# Altium schematic sheet Logic_controller.SchDoc
size A2; SheetNumber: 4; SheetTotal: 6
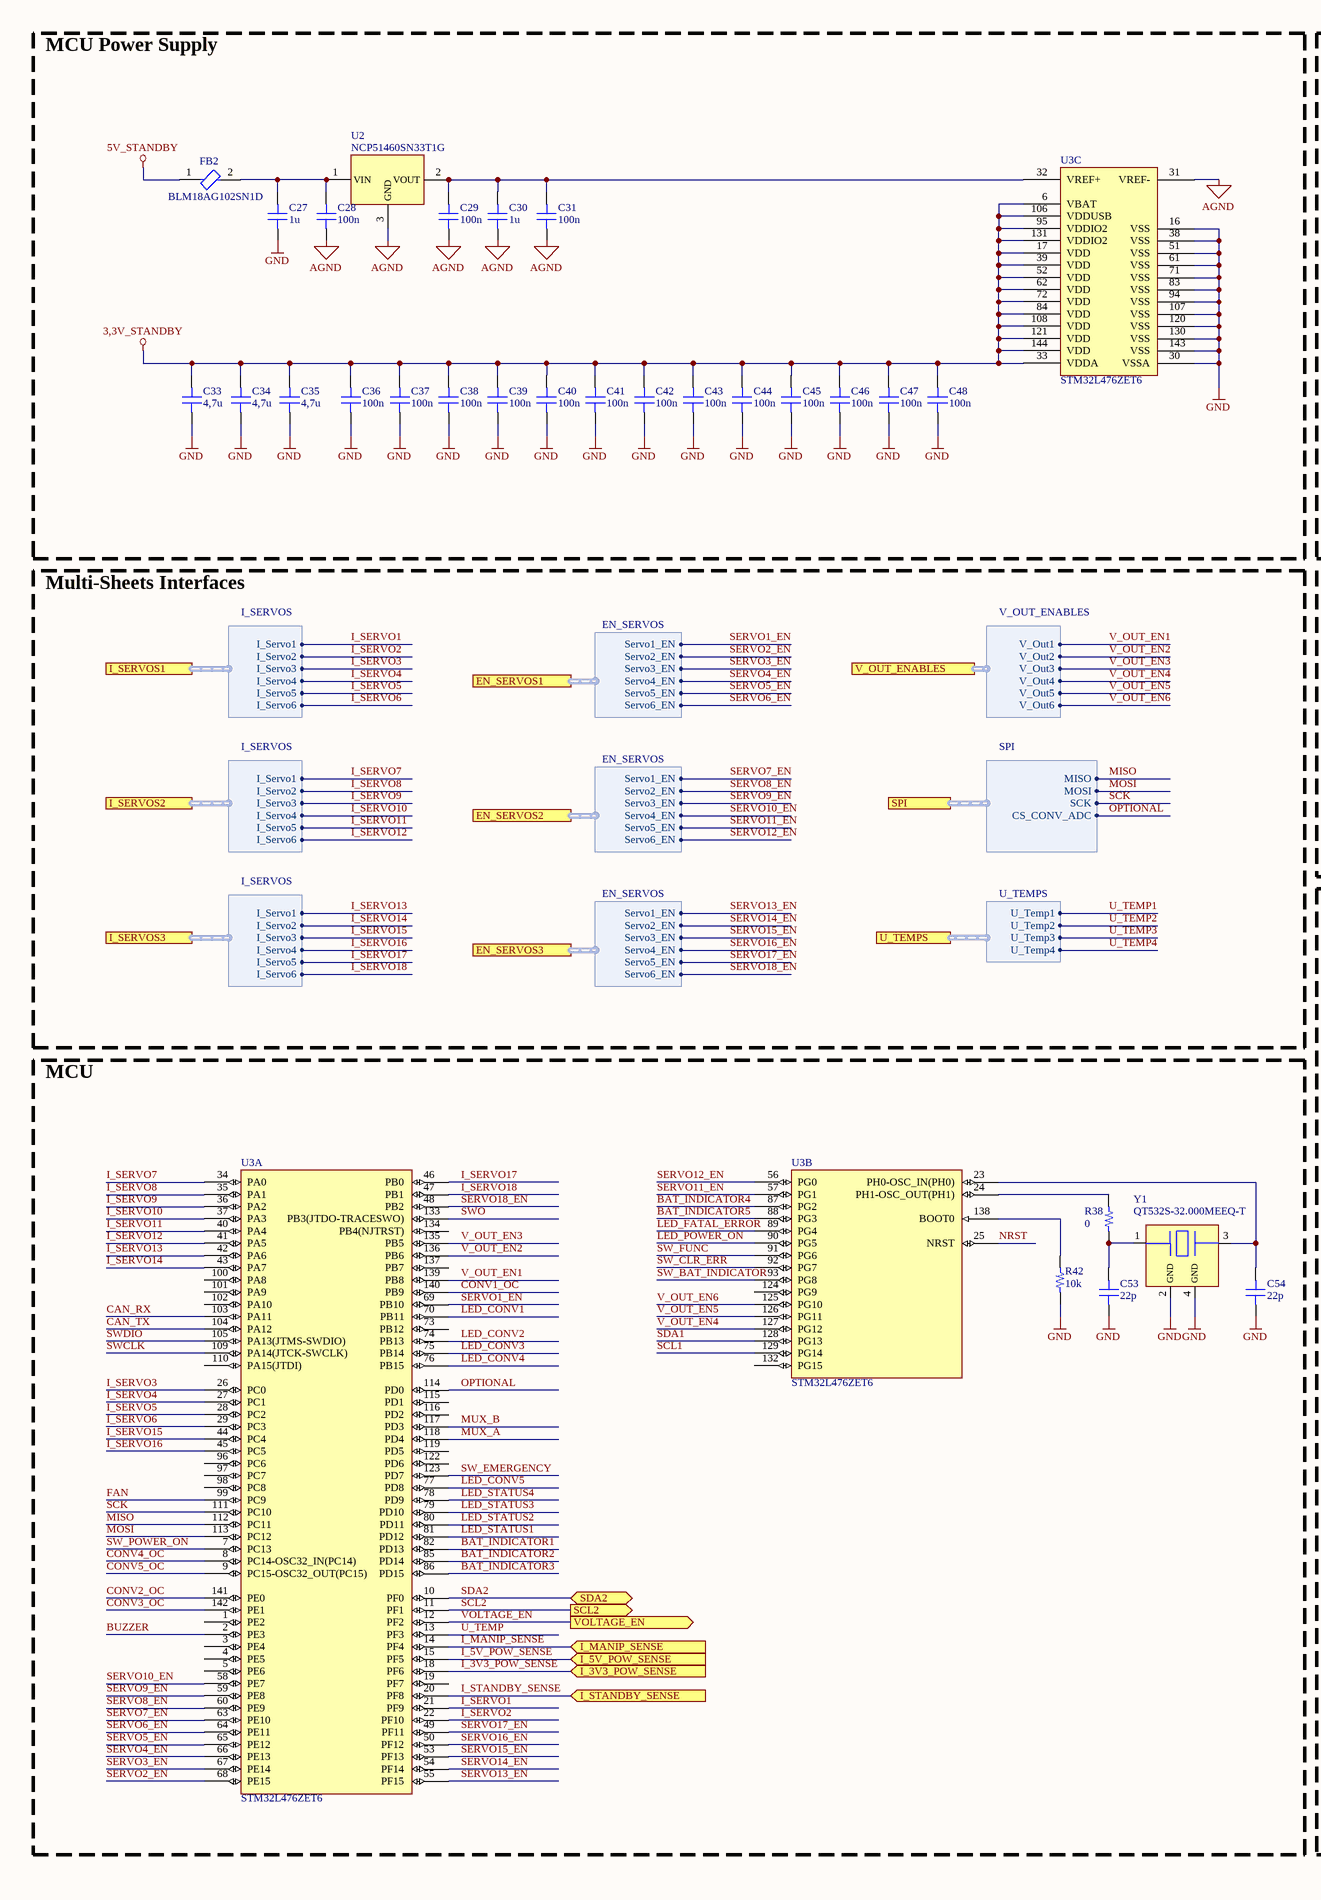
[diagram p0: Logic_controller.SchDoc, left]
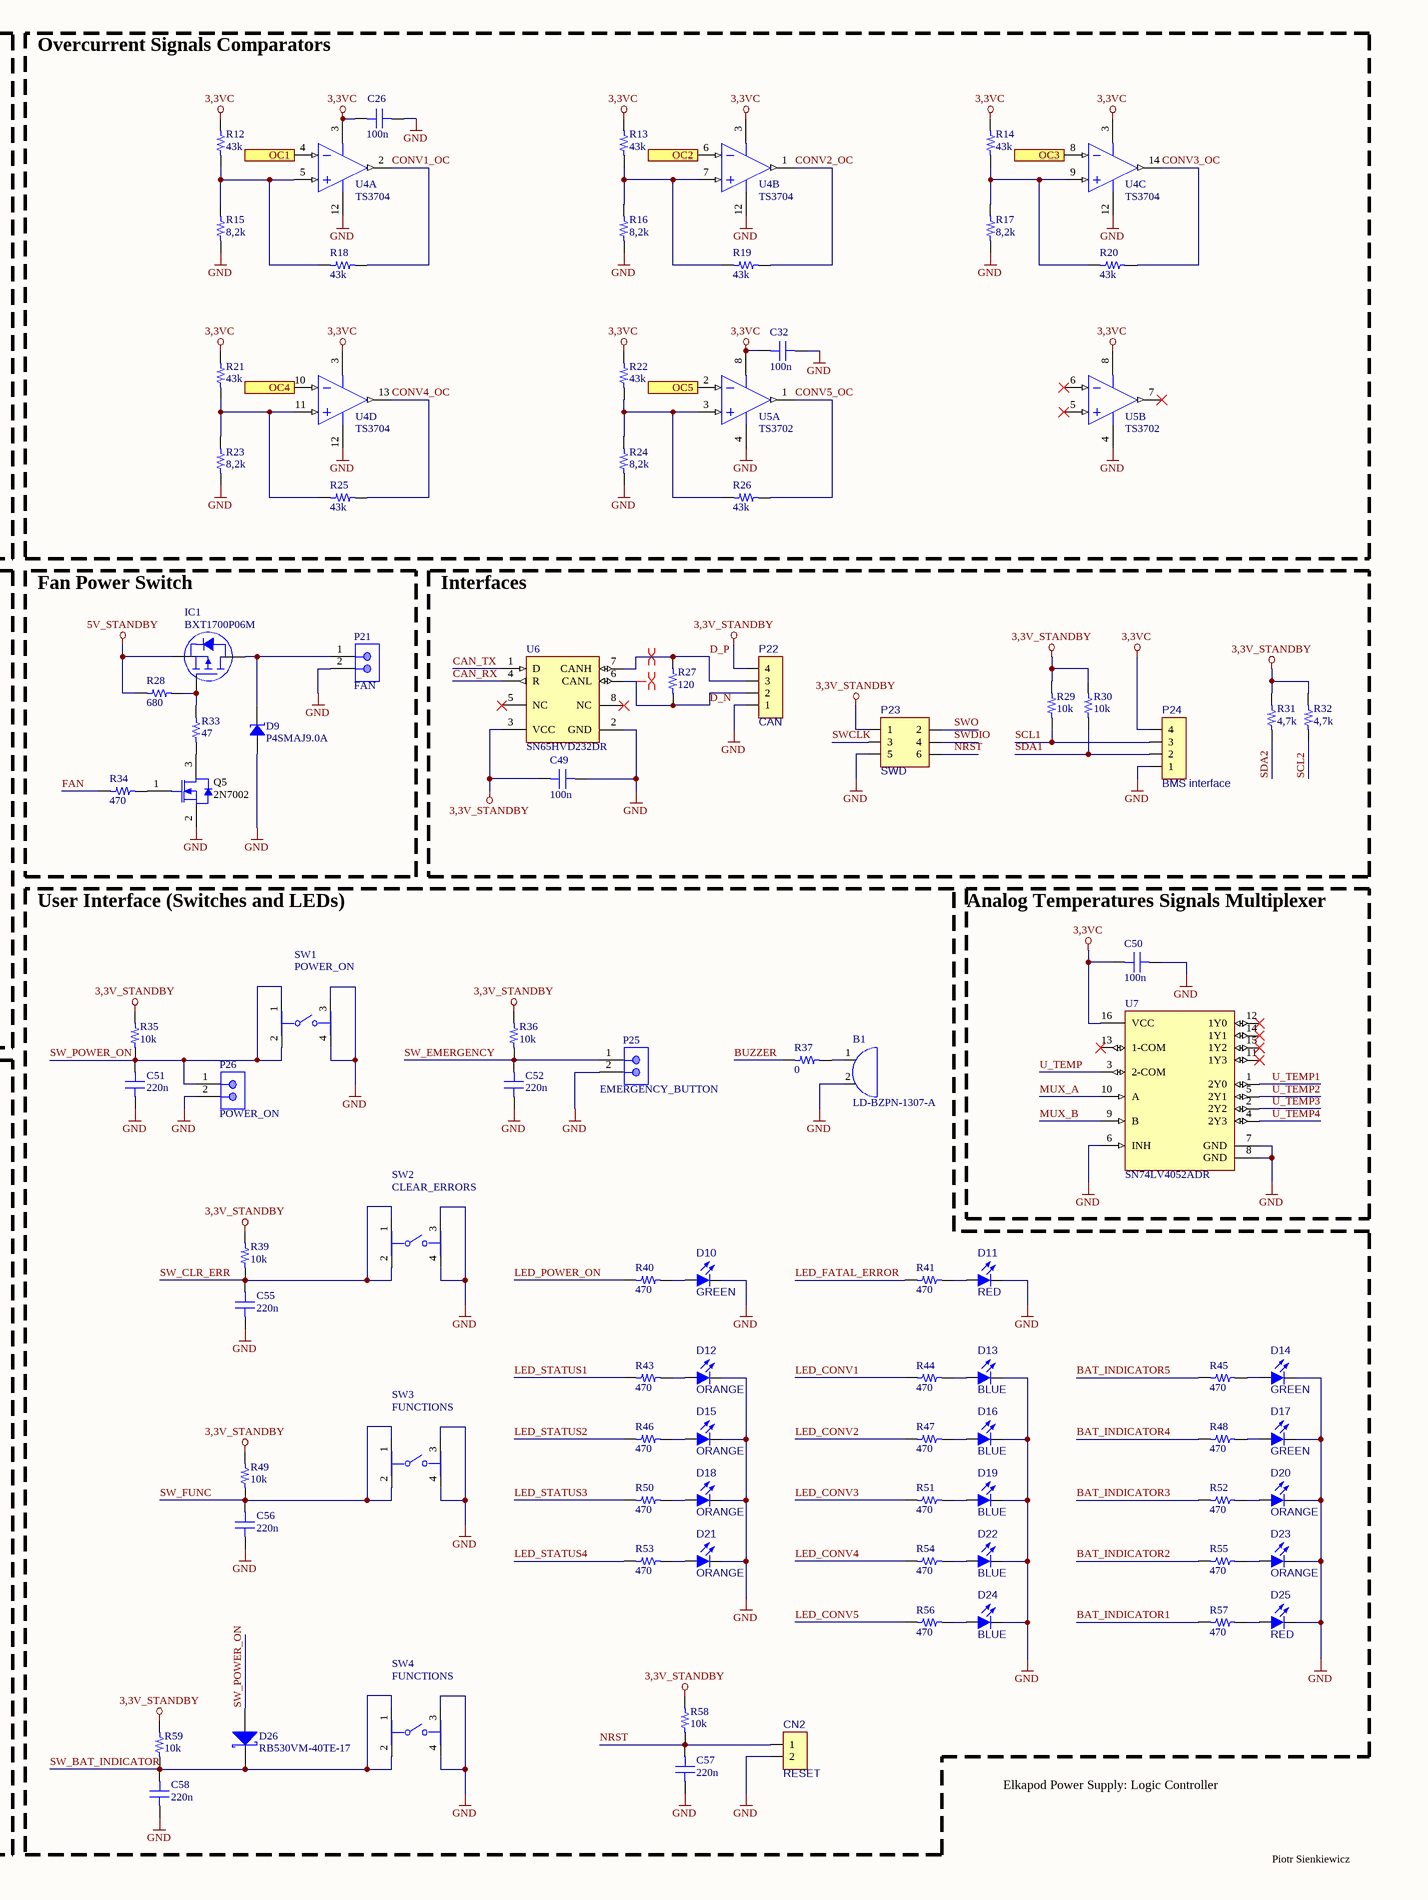
[diagram p1: Logic_controller.SchDoc, right]

## Parts
B1  LD-BZPN-1307-A  [LD-BZPN-1307-A]
C26  100n  [CAP 0603_1608]
C27  1u  [CAP 0603_1608]
C28  100n  [CAP 0603_1608]
C29  100n  [CAP 0603_1608]
C30  1u  [CAP 0603_1608]
C31  100n  [CAP 0603_1608]
C32  100n  [CAP 0603_1608]
C33  4,7u  [CAP 0603_1608]
C34  4,7u  [CAP 0603_1608]
C35  4,7u  [CAP 0603_1608]
C36  100n  [CAP 0603_1608]
C37  100n  [CAP 0603_1608]
C38  100n  [CAP 0603_1608]
C39  100n  [CAP 0603_1608]
C40  100n  [CAP 0603_1608]
C41  100n  [CAP 0603_1608]
C42  100n  [CAP 0603_1608]
C43  100n  [CAP 0603_1608]
C44  100n  [CAP 0603_1608]
C45  100n  [CAP 0603_1608]
C46  100n  [CAP 0603_1608]
C47  100n  [CAP 0603_1608]
C48  100n  [CAP 0603_1608]
C49  100n  [CAP 0603_1608]
C50  100n  [CAP 0603_1608]
C51  220n  [CAP 0603_1608]
C52  220n  [CAP 0603_1608]
C53  22p  [CAP 0603_1608]
C54  22p  [CAP 0603_1608]
C55  220n  [CAP 0603_1608]
C56  220n  [CAP 0603_1608]
C57  220n  [CAP 0603_1608]
C58  220n  [CAP 0603_1608]
CN2  RESET  [GP_2x1]
D9  P4SMAJ9.0A  [DO214AC SMA]
D10  GREEN  [LED0805B]
D11  RED  [LED0805B]
D12  ORANGE  [LED0805B]
D13  BLUE  [LED0805B]
D14  GREEN  [LED0805B]
D15  ORANGE  [LED0805B]
D16  BLUE  [LED0805B]
D17  GREEN  [LED0805B]
D18  ORANGE  [LED0805B]
D19  BLUE  [LED0805B]
D20  ORANGE  [LED0805B]
D21  ORANGE  [LED0805B]
D22  BLUE  [LED0805B]
D23  ORANGE  [LED0805B]
D24  BLUE  [LED0805B]
D25  RED  [LED0805B]
D26  RB530VM-40TE-17  [SOD-323]
FB2  BLM18AG102SN1D  [FP-BLM18-0_15-t0_8-MFG]
IC1  BXT1700P06M  [ON SEMI SOT-23-3]
P21  FAN  [MOLX-22-23-2021_V]
P22  CAN  [KK/2.54/4]
P23  SWD  [GP_3x2]
P24  BMS interface  [KK/2.54/4]
P25  EMERGENCY_BUTTON  [MOLX-22-23-2021_V]
P26  POWER_ON  [MOLX-22-23-2021_V]
Q5  2N7002  [INF-PG-SOT23_M]
R12  43k  [RES 0603_1608]
R13  43k  [RES 0603_1608]
R14  43k  [RES 0603_1608]
R15  8,2k  [RES 0603_1608]
R16  8,2k  [RES 0603_1608]
R17  8,2k  [RES 0603_1608]
R18  43k  [RES 0603_1608]
R19  43k  [RES 0603_1608]
R20  43k  [RES 0603_1608]
R21  43k  [RES 0603_1608]
R22  43k  [RES 0603_1608]
R23  8,2k  [RES 0603_1608]
R24  8,2k  [RES 0603_1608]
R25  43k  [RES 0603_1608]
R26  43k  [RES 0603_1608]
R27  120  [RES 0603_1608]
R28  680  [RES 0603_1608]
R29  10k  [RES 0603_1608]
R30  10k  [RES 0603_1608]
R31  4,7k  [RES 0603_1608]
R32  4,7k  [RES 0603_1608]
R33  47  [RES 0603_1608]
R34  470  [RES 0603_1608]
R35  10k  [RES 0603_1608]
R36  10k  [RES 0603_1608]
R37  0  [RES 0603_1608]
R38  0  [RES 0603_1608]
R39  10k  [RES 0603_1608]
R40  470  [RES 0603_1608]
R41  470  [RES 0603_1608]
R42  10k  [RES 0603_1608]
R43  470  [RES 0603_1608]
R44  470  [RES 0603_1608]
R45  470  [RES 0603_1608]
R46  470  [RES 0603_1608]
R47  470  [RES 0603_1608]
R48  470  [RES 0603_1608]
R49  10k  [RES 0603_1608]
R50  470  [RES 0603_1608]
R51  470  [RES 0603_1608]
R52  470  [RES 0603_1608]
R53  470  [RES 0603_1608]
R54  470  [RES 0603_1608]
R55  470  [RES 0603_1608]
R56  470  [RES 0603_1608]
R57  470  [RES 0603_1608]
R58  10k  [RES 0603_1608]
R59  10k  [RES 0603_1608]
SW1  POWER_ON  [FP-B3FS-1000-MFG]
SW2  CLEAR_ERRORS  [FP-B3FS-1000-MFG]
SW3  FUNCTIONS  [FP-B3FS-1000-MFG]
SW4  FUNCTIONS  [FP-B3FS-1000-MFG]
U2  NCP51460SN33T1G  [SOT23-3]
U3  STM32L476ZET6  [STM-LQFP144_M]  (parts A,B,C of 3)
U4  TS3704  [SOIC14]  (parts A,B,C,D of 4)
U5  TS3702  [SOIC8]  (parts A,B of 2)
U6  SN65HVD232DR  [D0008A_M]
U7  SN74LV4052ADR  [FP-D0016A-IPC_B]
Y1  QT532S-32.000MEEQ-T  [QT532S_5,0x3,2_crystal]

## Blocks framed on the sheet
MCU Power Supply: C27-C31 C33-C48 FB2 U2 U3
Overcurrent Signals Comparators: C26 C32 R12-R26 U4 U5
Fan Power Switch: D9 IC1 P21 Q5 R28 R33 R34
Interfaces: C49 P22-P24 R27 R29-R32 U6
User Interface (Switches and LEDs): B1 C51 C52 C55-C58 CN2 D10-D26 P25 P26 R35-R37 R39-R41 R43-R59 SW1-SW4
Analog Temperatures Signals Multiplexer: C50 U7
MCU: C53 C54 R38 R42 U3 Y1

## Ports
EN_SERVOS1 (harness EN_SERVOS, see Elkapod_power_supply_controller_module[3C]), EN_SERVOS2 (harness EN_SERVOS, see Elkapod_power_supply_controller_module[3D]), EN_SERVOS3 (harness EN_SERVOS, see Elkapod_power_supply_controller_module[3D]), I_3V3_POW_SENSE (in, see Elkapod_power_supply_controller_module[3C]), I_5V_POW_SENSE (in, see Elkapod_power_supply_controller_module[3C]), I_MANIP_SENSE (in, see Elkapod_power_supply_controller_module[3C]), I_SERVOS1 (harness I_SERVOS, see Elkapod_power_supply_controller_module[3C]), I_SERVOS2 (harness I_SERVOS, see Elkapod_power_supply_controller_module[3D]), I_SERVOS3 (harness I_SERVOS, see Elkapod_power_supply_controller_module[3D]), I_STANDBY_SENSE (in, see Elkapod_power_supply_controller_module[3C]), OC1 (in, see Elkapod_power_supply_controller_module[3C]), OC2 (in, see Elkapod_power_supply_controller_module[3C]), OC3 (in, see Elkapod_power_supply_controller_module[3C]), OC4 (in, see Elkapod_power_supply_controller_module[3C]), OC5 (in, see Elkapod_power_supply_controller_module[3C]), SCL2 (out, see Elkapod_power_supply_controller_module[3C]), SDA2 (bidir, see Elkapod_power_supply_controller_module[3C]), SPI (harness SPI, see Elkapod_power_supply_controller_module[5C]), U_TEMPS (harness U_TEMPS, see Elkapod_power_supply_controller_module[5C]), V_OUT_ENABLES (harness V_OUT_ENABLES, see Elkapod_power_supply_controller_module[5D], Controllable_voltage_outputs[2A]), VOLTAGE_EN (out, see Elkapod_power_supply_controller_module[5C])

## Harnesses
I_SERVOS: I_Servo1, I_Servo2, I_Servo3, I_Servo4, I_Servo5, I_Servo6
V_OUT_ENABLES: V_Out1, V_Out2, V_Out3, V_Out4, V_Out5, V_Out6
SPI: MISO, MOSI, SCK, CS_CONV_ADC
EN_SERVOS: Servo1_EN, Servo2_EN, Servo3_EN, Servo4_EN, Servo5_EN, Servo6_EN
U_TEMPS: U_Temp1, U_Temp2, U_Temp3, U_Temp4

## Nets
3,3V_STANDBY: C33.2 C34.2 C35.2 C36.2 C37.2 C38.2 C39.2 C40.2 C41.2 C42.2 C43.2 C44.2 C45.2 C46.2 C47.2 C48.2 C49.2 P22.4 P23.1 R29.1 R30.1 R31.1 R32.1 R35.1 R36.1 R39.1 R49.1 R58.1 R59.1 U3.6(VBAT) U3.17(VDD) U3.33(VDDA) U3.39(VDD) U3.52(VDD) U3.62(VDD) U3.72(VDD) U3.84(VDD) U3.95(VDDIO2) U3.106(VDDUSB) U3.108(VDD) U3.121(VDD) U3.131(VDDIO2) U3.144(VDD) U6.3(VCC)
3,3VC: C26.2 C32.2 C50.2 P24.4 R12.2 R13.2 R14.2 R21.2 R22.2 U4.3(V+) U5.8(V+) U7.16(VCC)
5V_STANDBY: FB2.1 IC1.2(S) R28.1
AGND: C28.1 C29.1 C30.1 C31.1 U2.3(GND) U3.31(VREF-)
GND: B1.2 C26.1 C27.1 C32.1 C33.1 C34.1 C35.1 C36.1 C37.1 C38.1 C39.1 C40.1 C41.1 C42.1 C43.1 C44.1 C45.1 C46.1 C47.1 C48.1 C49.1 C50.1 C51.1 C52.1 C53.1 C54.1 C55.1 C56.1 C57.1 C58.1 CN2.2 D9.1 D10.2(K) D11.2(K) D12.2(K) D13.2(K) D14.2(K) D15.2(K) D16.2(K) D17.2(K) D18.2(K) D19.2(K) D20.2(K) D21.2(K) D22.2(K) D23.2(K) D24.2(K) D25.2(K) P21.2 P22.1 P23.5 P24.1 P25.2 P26.2 Q5.2(SOURCE) R15.2 R16.2 R17.2 R23.2 R24.2 R42.2 SW1.3 SW1.4 SW2.3 SW2.4 SW3.3 SW3.4 SW4.3 SW4.4 U3.16(VSS) U3.30(VSSA) U3.38(VSS) U3.51(VSS) U3.61(VSS) U3.71(VSS) U3.83(VSS) U3.94(VSS) U3.107(VSS) U3.120(VSS) U3.130(VSS) U3.143(VSS) U4.12(GND) U5.4(GND) U6.2(GND) U7.6(INH) U7.7(GND) U7.8(GND) Y1.2(GND) Y1.4(GND)
BAT_INDICATOR1: R57.2 U3.82(PD13)
BAT_INDICATOR2: R55.2 U3.85(PD14)
BAT_INDICATOR3: R52.2 U3.86(PD15)
BAT_INDICATOR4: R48.2 U3.87(PG2)
BAT_INDICATOR5: R45.2 U3.88(PG3)
BUZZER: R37.1 U3.2(PE3)
CAN_RX: U3.103(PA11) U6.4(R)
CAN_TX: U3.104(PA12) U6.1(D)
CONV1_OC: R18.2 U3.140(PB9) U4.2(OUT1)
CONV2_OC: R19.1 U3.141(PE0) U4.1(OUT2)
CONV3_OC: R20.1 U3.142(PE1) U4.14(OUT3)
CONV4_OC: R25.1 U3.8(PC14-OSC32_IN(PC14)) U4.13(OUT4)
CONV5_OC: R26.1 U3.9(PC15-OSC32_OUT(PC15)) U5.1(OUT1)
D_N: P22.2 R27.2 U6.6(CANL)
D_P: P22.3 R27.1 U6.7(CANH)
FAN: R34.1 U3.99(PC9)
I_3V3_POW_SENSE: U3.18(PF6) ; port I_3V3_POW_SENSE
I_5V_POW_SENSE: U3.15(PF5) ; port I_5V_POW_SENSE
I_MANIP_SENSE: U3.14(PF4) ; port I_MANIP_SENSE
I_SERVO1: U3.21(PF9) ; port I_SERVOS1.I_Servo1
I_SERVO2: U3.22(PF10) ; port I_SERVOS1.I_Servo2
I_SERVO3: U3.26(PC0) ; port I_SERVOS1.I_Servo3
I_SERVO4: U3.27(PC1) ; port I_SERVOS1.I_Servo4
I_SERVO5: U3.28(PC2) ; port I_SERVOS1.I_Servo5
I_SERVO6: U3.29(PC3) ; port I_SERVOS1.I_Servo6
I_SERVO7: U3.34(PA0) ; port I_SERVOS2.I_Servo1
I_SERVO8: U3.35(PA1) ; port I_SERVOS2.I_Servo2
I_SERVO9: U3.36(PA2) ; port I_SERVOS2.I_Servo3
I_SERVO10: U3.37(PA3) ; port I_SERVOS2.I_Servo4
I_SERVO11: U3.40(PA4) ; port I_SERVOS2.I_Servo5
I_SERVO12: U3.41(PA5) ; port I_SERVOS2.I_Servo6
I_SERVO13: U3.42(PA6) ; port I_SERVOS3.I_Servo1
I_SERVO14: U3.43(PA7) ; port I_SERVOS3.I_Servo2
I_SERVO15: U3.44(PC4) ; port I_SERVOS3.I_Servo3
I_SERVO16: U3.45(PC5) ; port I_SERVOS3.I_Servo4
I_SERVO17: U3.46(PB0) ; port I_SERVOS3.I_Servo5
I_SERVO18: U3.47(PB1) ; port I_SERVOS3.I_Servo6
I_STANDBY_SENSE: U3.20(PF8) ; port I_STANDBY_SENSE
LED_CONV1: R44.2 U3.70(PB11)
LED_CONV2: R47.2 U3.74(PB13)
LED_CONV3: R51.2 U3.75(PB14)
LED_CONV4: R54.2 U3.76(PB15)
LED_CONV5: R56.2 U3.77(PD8)
LED_FATAL_ERROR: R41.2 U3.89(PG4)
LED_POWER_ON: R40.2 U3.90(PG5)
LED_STATUS1: R43.2 U3.81(PD12)
LED_STATUS2: R46.2 U3.80(PD11)
LED_STATUS3: R50.2 U3.79(PD10)
LED_STATUS4: R53.2 U3.78(PD9)
MISO: U3.112(PC11) ; port SPI.MISO
MOSI: U3.113(PC12) ; port SPI.MOSI
MUX_A: U3.118(PD4) U7.10(A)
MUX_B: U3.117(PD3) U7.9(B)
NRST: C57.2 CN2.1 P23.6 R58.2 U3.25(NRST)
OC1: U4.4(IN1-) ; port OC1
OC2: U4.6(IN2-) ; port OC2
OC3: U4.8(IN3-) ; port OC3
OC4: U4.10(IN4-) ; port OC4
OC5: U5.2(IN1-) ; port OC5
OPTIONAL: U3.114(PD0) ; port SPI.CS_CONV_ADC
SCK: U3.111(PC10) ; port SPI.SCK
SCL1: P24.3 R29.2 U3.129(PG14)
SCL2: R32.2 U3.11(PF1) ; port SCL2
SDA1: P24.2 R30.2 U3.128(PG13)
SDA2: R31.2 U3.10(PF0) ; port SDA2
SERVO1_EN: U3.69(PB10) ; port EN_SERVOS1.Servo1_EN
SERVO2_EN: U3.68(PE15) ; port EN_SERVOS1.Servo2_EN
SERVO3_EN: U3.67(PE14) ; port EN_SERVOS1.Servo3_EN
SERVO4_EN: U3.66(PE13) ; port EN_SERVOS1.Servo4_EN
SERVO5_EN: U3.65(PE12) ; port EN_SERVOS1.Servo5_EN
SERVO6_EN: U3.64(PE11) ; port EN_SERVOS1.Servo6_EN
SERVO7_EN: U3.63(PE10) ; port EN_SERVOS2.Servo1_EN
SERVO8_EN: U3.60(PE9) ; port EN_SERVOS2.Servo2_EN
SERVO9_EN: U3.59(PE8) ; port EN_SERVOS2.Servo3_EN
SERVO10_EN: U3.58(PE7) ; port EN_SERVOS2.Servo4_EN
SERVO11_EN: U3.57(PG1) ; port EN_SERVOS2.Servo5_EN
SERVO12_EN: U3.56(PG0) ; port EN_SERVOS2.Servo6_EN
SERVO13_EN: U3.55(PF15) ; port EN_SERVOS3.Servo1_EN
SERVO14_EN: U3.54(PF14) ; port EN_SERVOS3.Servo2_EN
SERVO15_EN: U3.53(PF13) ; port EN_SERVOS3.Servo3_EN
SERVO16_EN: U3.50(PF12) ; port EN_SERVOS3.Servo4_EN
SERVO17_EN: U3.49(PF11) ; port EN_SERVOS3.Servo5_EN
SERVO18_EN: U3.48(PB2) ; port EN_SERVOS3.Servo6_EN
SW_BAT_INDICATOR: C58.2 D26.1(K) R59.2 SW4.1 SW4.2 U3.93(PG8)
SW_CLR_ERR: C55.2 R39.2 SW2.1 SW2.2 U3.92(PG7)
SW_EMERGENCY: C52.2 P25.1 R36.2 U3.123(PD7)
SW_FUNC: C56.2 R49.2 SW3.1 SW3.2 U3.91(PG6)
SW_POWER_ON: C51.2 D26.2(A) P26.1 R35.2 SW1.1 SW1.2 U3.7(PC13)
SWCLK: P23.3 U3.109(PA14(JTCK-SWCLK))
SWDIO: P23.4 U3.105(PA13(JTMS-SWDIO))
SWO: P23.2 U3.133(PB3(JTDO-TRACESWO))
U_TEMP: U3.13(PF3) U7.3(2-COM)
U_TEMP1: U7.1(2Y0) ; port U_TEMPS.U_Temp1
U_TEMP2: U7.5(2Y1) ; port U_TEMPS.U_Temp2
U_TEMP3: U7.2(2Y2) ; port U_TEMPS.U_Temp3
U_TEMP4: U7.4(2Y3) ; port U_TEMPS.U_Temp4
V_OUT_EN1: U3.139(PB8) ; port V_OUT_ENABLES.V_Out1
V_OUT_EN2: U3.136(PB6) ; port V_OUT_ENABLES.V_Out2
V_OUT_EN3: U3.135(PB5) ; port V_OUT_ENABLES.V_Out3
V_OUT_EN4: U3.127(PG12) ; port V_OUT_ENABLES.V_Out4
V_OUT_EN5: U3.126(PG11) ; port V_OUT_ENABLES.V_Out5
V_OUT_EN6: U3.125(PG10) ; port V_OUT_ENABLES.V_Out6
VOLTAGE_EN: U3.12(PF2) ; port VOLTAGE_EN
NetB1_1: B1.1 R37.2
NetC27_2: C27.2 C28.2 FB2.2 U2.1(VIN)
NetC29_2: C29.2 C30.2 C31.2 U2.2(VOUT) U3.32(VREF+)
NetC53_2: C53.2 R38.1 Y1.1(OSC)
NetC54_2: C54.2 U3.23(PH0-OSC_IN(PH0)) Y1.3(OSC)
NetD9_2: D9.2 IC1.3(D) P21.1
NetD10_1: D10.1(A) R40.1
NetD11_1: D11.1(A) R41.1
NetD12_1: D12.1(A) R43.1
NetD13_1: D13.1(A) R44.1
NetD14_1: D14.1(A) R45.1
NetD15_1: D15.1(A) R46.1
NetD16_1: D16.1(A) R47.1
NetD17_1: D17.1(A) R48.1
NetD18_1: D18.1(A) R50.1
NetD19_1: D19.1(A) R51.1
NetD20_1: D20.1(A) R52.1
NetD21_1: D21.1(A) R53.1
NetD22_1: D22.1(A) R54.1
NetD23_1: D23.1(A) R55.1
NetD24_1: D24.1(A) R56.1
NetD25_1: D25.1(A) R57.1
NetIC1_1: IC1.1(G) R28.2 R33.1
NetQ5_1: Q5.1(GATE) R34.2
NetQ5_3: Q5.3(DRAIN) R33.2
NetR12_1: R12.1 R15.1 R18.1 U4.5(IN1+)
NetR13_1: R13.1 R16.1 R19.2 U4.7(IN2+)
NetR14_1: R14.1 R17.1 R20.2 U4.9(IN3+)
NetR21_1: R21.1 R23.1 R25.2 U4.11(IN4+)
NetR22_1: R22.1 R24.1 R26.2 U5.3(IN1+)
NetR38_2: R38.2 U3.24(PH1-OSC_OUT(PH1))
NetR42_1: R42.1 U3.138(BOOT0)

Not connected (* = marked no-connect by the designer): U3 1(PE2) 3(PE4) 4(PE5) 5(PE6) 19(PF7) 73(PB12) 96(PC6) 97(PC7) 98(PC8) 100(PA8) 101(PA9) 102(PA10) 110(PA15(JTDI)) 115(PD1) 116(PD2) 119(PD5) 122(PD6) 124(PG9) 132(PG15) 134(PB4(NJTRST)) 137(PB7); U5 5(IN2+)* 6(IN2-)* 7(OUT2)*; U6 5(NC)* 8(NC)*; U7 11(1Y3)* 12(1Y0)* 13(1-COM)* 14(1Y1)* 15(1Y2)*

## Layout directives
differential pair: D_N, D_P

## Notes on the sheet
- Multi-Sheets Interfaces
- Elkapod Power Supply: Logic Controller
- Piotr Sienkiewicz

## Library data of the parts
B1 = LD-BZPN-1307-A: 12,6mm diameter buzzer without generator; 1-30VAC
C26 C28 C29 C31 C32 C36-C50 = C0603C272F3GAC7867: CAP CER 100nF 25V X5R 0603; manufacturer: KEMET; Temperature Coefficient: C0G, NP0; Tolerance: ±1%; Part Number: C0603C272F3GAC7867; Value: 100n; Applications: General Purpose; Capacitance: 100n; componentlink1description: Datasheet; componentlink1url: https://api.kemet.com/component-edge/download/datasheet/C0603C272F3GACTU.pdf; componentlink2description: DigiKey Link; componentlink2url: https://www.digikey.com/en/products/detail/kemet/C0603C272F3GAC7867/2200413; Device Package: 0603 (1608 Metric); Features: Low ESL; lastupdated: 09.02.2024 20:10:30; Lifecycle Status: Active; Minimum Order: 1; Mounting Type: Surface Mount, MLCC; Operating Temperature: -55°C ~ 125°C; Package / Case: 0603 (1608 Metric); packaging: TapeAndReel; partid: 2138; Part Status: Active; price: 0.40; series: SMD Comm C0G; Size / Dimension: 0.063" L x 0.031" W (1.60mm x 0.80mm); Thickness (Max): 0.034" (0.87mm); Voltage - Rated: 25V
C27 C30 = C0603C272F3GAC7867: CAP CER 1uF 16V X5R 0603; manufacturer: KEMET; Temperature Coefficient: C0G, NP0; Tolerance: ±1%; Voltage - Rated: 25V; Part Number: C0603C272F3GAC7867; Value: 1u; Applications: General Purpose; Capacitance: 1u; componentlink1description: Datasheet; componentlink1url: https://api.kemet.com/component-edge/download/datasheet/C0603C272F3GACTU.pdf; componentlink2description: DigiKey Link; componentlink2url: https://www.digikey.com/en/products/detail/kemet/C0603C272F3GAC7867/2200413; Device Package: 0603 (1608 Metric); Features: Low ESL; lastupdated: 09.02.2024 20:10:30; Lifecycle Status: Active; Minimum Order: 1; Mounting Type: Surface Mount, MLCC; Operating Temperature: -55°C ~ 125°C; Package / Case: 0603 (1608 Metric); packaging: TapeAndReel; partid: 2138; Part Status: Active; price: 0.40; series: SMD Comm C0G; Size / Dimension: 0.063" L x 0.031" W (1.60mm x 0.80mm); Thickness (Max): 0.034" (0.87mm)
C33-C35 = C0603C272F3GAC7867: CAP CER 4,7uF 25V X5R 0603; manufacturer: KEMET; Temperature Coefficient: C0G, NP0; Tolerance: ±1%; Part Number: C0603C272F3GAC7867; Value: 4,7u; Applications: General Purpose; Capacitance: 4,7u; componentlink1description: Datasheet; componentlink1url: https://api.kemet.com/component-edge/download/datasheet/C0603C272F3GACTU.pdf; componentlink2description: DigiKey Link; componentlink2url: https://www.digikey.com/en/products/detail/kemet/C0603C272F3GAC7867/2200413; Device Package: 0603 (1608 Metric); Features: Low ESL; lastupdated: 09.02.2024 20:10:30; Lifecycle Status: Active; Minimum Order: 1; Mounting Type: Surface Mount, MLCC; Operating Temperature: -55°C ~ 125°C; Package / Case: 0603 (1608 Metric); packaging: TapeAndReel; partid: 2138; Part Status: Active; price: 0.40; series: SMD Comm C0G; Size / Dimension: 0.063" L x 0.031" W (1.60mm x 0.80mm); Thickness (Max): 0.034" (0.87mm); Voltage - Rated: 25V
C51 C52 C55-C58 = C0603C272F3GAC7867: CAP CER 220nF 25V X5R 0603; manufacturer: KEMET; Temperature Coefficient: C0G, NP0; Tolerance: ±1%; Part Number: C0603C272F3GAC7867; Value: 220n; Applications: General Purpose; Capacitance: 220n; componentlink1description: Datasheet; componentlink1url: https://api.kemet.com/component-edge/download/datasheet/C0603C272F3GACTU.pdf; componentlink2description: DigiKey Link; componentlink2url: https://www.digikey.com/en/products/detail/kemet/C0603C272F3GAC7867/2200413; Device Package: 0603 (1608 Metric); Features: Low ESL; lastupdated: 09.02.2024 20:10:30; Lifecycle Status: Active; Minimum Order: 1; Mounting Type: Surface Mount, MLCC; Operating Temperature: -55°C ~ 125°C; Package / Case: 0603 (1608 Metric); packaging: TapeAndReel; partid: 2138; Part Status: Active; price: 0.40; series: SMD Comm C0G; Size / Dimension: 0.063" L x 0.031" W (1.60mm x 0.80mm); Thickness (Max): 0.034" (0.87mm); Voltage - Rated: 25V
C53 C54 = C0603C272F3GAC7867: CAP CER 22pF 50V G0C 0603; manufacturer: KEMET; Temperature Coefficient: C0G, NP0; Tolerance: ±1%; Voltage - Rated: 25V; Part Number: C0603C272F3GAC7867; Value: 22p; Applications: General Purpose; Capacitance: 22p; componentlink1description: Datasheet; componentlink1url: https://api.kemet.com/component-edge/download/datasheet/C0603C272F3GACTU.pdf; componentlink2description: DigiKey Link; componentlink2url: https://www.digikey.com/en/products/detail/kemet/C0603C272F3GAC7867/2200413; Device Package: 0603 (1608 Metric); Features: Low ESL; lastupdated: 09.02.2024 20:10:30; Lifecycle Status: Active; Minimum Order: 1; Mounting Type: Surface Mount, MLCC; Operating Temperature: -55°C ~ 125°C; Package / Case: 0603 (1608 Metric); packaging: TapeAndReel; partid: 2138; Part Status: Active; price: 0.40; series: SMD Comm C0G; Size / Dimension: 0.063" L x 0.031" W (1.60mm x 0.80mm); Thickness (Max): 0.034" (0.87mm)
CN2 = CN_2x1
D9 = SMA6J18A-TP: TVS DIODE 9VDC DO214AC; Part Number: P4SMAJ9.0A
D10 D14 D17 = LED_BLUE: GREEN LED; Published: 04-Apr-2006
D11 D25 = LED_BLUE: RED LED; Published: 04-Apr-2006
D12 D15 D18 D20 D21 D23 = LED_BLUE: ORANGE LED; Published: 04-Apr-2006
D13 D16 D19 D22 D24 = LED_BLUE: BLUE LED; Published: 04-Apr-2006
D26 = BAS140W: Schottky diode; 0,1A; 40V; Published: 21-Mar-2003; LatestRevisionDate: 19-Mar-2004; LatestRevisionNote: Silkscreen size reduced.; DatasheetDocument: Oct-1999; PackageDocument: Sep-2000; PackageReference: SOD-323; Publisher: Altium Limited; ComponentLink1Description: Manufacturer Link; ComponentLink1URL: http://www.infineon.com/; ComponentLink2Description: Datasheet; ComponentLink2URL: http://www.infineon.com/upload/Document/cmc_upload/documents/009/386/bas70_bas170series_1.pdf
FB2 = CMP-0686-00457-3: Chip Ferrite Bead, 0603, 1000Ω @ 100MHz, 0.5Ω, 25%, 450mA; Number of Circuits: 1; Max DC Current: 400mA; Shielding: Unshielded; DC Resistance (DCR): 500mR; Material: Steel; DC Resistance-Max: 700mR; Impedance: 1kR; Case Code (Imperial): 0603; Max Current Rating: 400mA; Frequency: 100MHz; Min Operating Temperature: -55°C; Case/Package: 0603; Depth: 0.8mm; Lead Free: Lead Free; Core Material: Ferrite; Current Rating: 400mA; Resistance: 500mR; Case Code (Metric): 1608; DC Current: 400mA; Package Quantity: 1; Packaging: Tape and Reel; Width: 0.8mm; Military Standard: Not; Height: 0.8mm; Series: BLM18A; Max Operating Temperature: 125°C; Tolerance: 25%; Termination: SMD/SMT; Test Frequency: 100MHz; Number of Lines: 1; Number of Pins: 2; REACH SVHC: No SVHC; Length: 1.6mm; Radiation Hardening: No
IC1 = NTRV4101PT1G: MOSFET P-CH 60V 2.8A SOT-23-3; Part Number: BXT1700P06M
P21 P25 P26 = CMP-1704-00001-3: Male Header, Pitch 2.54 mm, 1 x 2 Position, Height 10.67 mm, Tail Length 3.56 mm, 0 to 75 degC, RoHS, Bulk; Package Quantity: 3000; Height: 10.67 mm; RoHSCompliant: True; ComponentLink2URL: https://datasheet.ciiva.com/19454/232266-19454304.pdf; PartNumber: 22-23-2021; Packaging: Bulk; ComponentLink2Description: Datasheet; Min Operating Temperature: 0 degC; ComponentLink1Description: Manufacturer URL; Length: 5.08 mm; Mounting Technology: Through Hole; Max Operating Temperature: 75 degC; REACH SVHC: Unknown; PackageDescription: Male Header, Pitch 2.54 mm, 1 x 2 Position, Height 10.67 mm, Tail Length 3.56 mm; ComponentLink1URL: http://www.molex.com/; Mount: Through Hole; Radiation Hardening: No; Width: 6.35 mm; Pins: 2
P22 P24 = CN_4x1: Connector: PCB-cable; KK; socket; male; PIN:4; straight/right-angle; tinned; THT
P23 = CN_3x2
Q5 = CMP-1149-00026-1: N-Channel OptiMOS Small-Signal-Transistor, 60 V VDS, 0.3 A ID, -55 to 150 degC, PG-SOT23, Reel, Green; Manufacturer: Infineon; RDS (on) (max) (@4.5V): 4,000 mOhm; VDS (max): 60 V; IDpuls (max): 1.2Â A; QG: 0.4Â nC; RDS (on) (max): 3,000 mOhm; RthJA (max): 250 K/W; ID (max): 0.3Â A; VGS(th) (max): 2.5Â V; VGS(th) (min): 1.5Â V; Green: TRUE; Ptot (max): 0.5Â W; PackageDescription: 3-Pin Small Outline Transistor Package, 2.9 x 1.3 mm Body, 0.95 mm Pitch; Halogen-free: TRUE; ComponentLink2Description: Datasheet; ComponentLink1URL: http://www.infineon.com/; Packing: Reel; DatasheetVersion: Rev. 2.4; PartNumber: 2N7002; PackageReference: PG-SOT23; PackageVersion: Apr-08; ComponentLink3URL: http://www.infineon.com/dgdl/SOT23-Package_Overview.pdf?folderId=db3a30431936bc4b0119532290053c66&fileId=db3a30431936bc4b0119533468123c85; ComponentLink1Description: Manufacturer URL; Mounting Technology: Surface Mount; ComponentLink3Description: Package Specification; ComponentLink2URL: http://www.infineon.com/dgdl/2N7002_Rev2.4.pdf?folderId=db3a3043156fd573011622e10b5c1f67&fileId=db3a304319bc939a0119c2a9461e79e6
R12-R14 R18-R22 R25 R26 = RNCS0603BKE10K0: RES 43K OHM 1% 0,1W 0603; Manufacturer: Stackpole Electronics Inc; Power (Watts): 0.063W, 1/16W; Temperature Coefficient: ±25ppm/°C; Tolerance: ±0.1%; Part Number: RNCS0603BKE10K0; Value: 43k; Composition: Thin Film; Device Package: 0603 (1608 Metric); Features: Anti-Corrosive, Automotive AEC-Q200, Moisture Resistant; Height - Seated (Max): 0.022" (0.55mm); LastUpdated: 09.02.2024 20:43:37; Lifecycle Status: Active; Minimum Order: 1; Number of Terminations: 2; Operating Temperature: -55°C ~ 155°C; Package / Case: 0603 (1608 Metric); Packaging: TapeAndReel; PartId: 4838; Part Status: Active; Price: 0.06; Ratings: AEC-Q200; Resistance: 43k; Series: RNCS; Size / Dimension: 0.061" L x 0.031" W (1.55mm x 0.80mm); Supplier Device Package: 0603
R15-R17 R23 R24 = RNCS0603BKE10K0: RES 8,2K OHM 1% 0,1W 0603; Manufacturer: Stackpole Electronics Inc; Power (Watts): 0.063W, 1/16W; Temperature Coefficient: ±25ppm/°C; Tolerance: ±0.1%; Part Number: RNCS0603BKE10K0; Value: 8,2k; Composition: Thin Film; Device Package: 0603 (1608 Metric); Features: Anti-Corrosive, Automotive AEC-Q200, Moisture Resistant; Height - Seated (Max): 0.022" (0.55mm); LastUpdated: 09.02.2024 20:43:37; Lifecycle Status: Active; Minimum Order: 1; Number of Terminations: 2; Operating Temperature: -55°C ~ 155°C; Package / Case: 0603 (1608 Metric); Packaging: TapeAndReel; PartId: 4838; Part Status: Active; Price: 0.06; Ratings: AEC-Q200; Resistance: 8,2k; Series: RNCS; Size / Dimension: 0.061" L x 0.031" W (1.55mm x 0.80mm); Supplier Device Package: 0603
R27 = RNCS0603BKE10K0: RES 120 OHM 1% 0,1W 0603; Manufacturer: Stackpole Electronics Inc; Power (Watts): 0.063W, 1/16W; Temperature Coefficient: ±25ppm/°C; Tolerance: ±0.1%; Part Number: RNCS0603BKE10K0; Value: 120; Composition: Thin Film; Device Package: 0603 (1608 Metric); Features: Anti-Corrosive, Automotive AEC-Q200, Moisture Resistant; Height - Seated (Max): 0.022" (0.55mm); LastUpdated: 09.02.2024 20:43:37; Lifecycle Status: Active; Minimum Order: 1; Number of Terminations: 2; Operating Temperature: -55°C ~ 155°C; Package / Case: 0603 (1608 Metric); Packaging: TapeAndReel; PartId: 4838; Part Status: Active; Price: 0.06; Ratings: AEC-Q200; Resistance: 120; Series: RNCS; Size / Dimension: 0.061" L x 0.031" W (1.55mm x 0.80mm); Supplier Device Package: 0603
R28 = RNCS0603BKE10K0: RES 680 OHM 1% 0,1W 0603; Manufacturer: Stackpole Electronics Inc; Power (Watts): 0.063W, 1/16W; Temperature Coefficient: ±25ppm/°C; Tolerance: ±0.1%; Part Number: RNCS0603BKE10K0; Value: 680; Composition: Thin Film; Device Package: 0603 (1608 Metric); Features: Anti-Corrosive, Automotive AEC-Q200, Moisture Resistant; Height - Seated (Max): 0.022" (0.55mm); LastUpdated: 09.02.2024 20:43:37; Lifecycle Status: Active; Minimum Order: 1; Number of Terminations: 2; Operating Temperature: -55°C ~ 155°C; Package / Case: 0603 (1608 Metric); Packaging: TapeAndReel; PartId: 4838; Part Status: Active; Price: 0.06; Ratings: AEC-Q200; Resistance: 680; Series: RNCS; Size / Dimension: 0.061" L x 0.031" W (1.55mm x 0.80mm); Supplier Device Package: 0603
R29 R30 R35 R36 R39 R42 R49 R58 R59 = RNCS0603BKE10K0: RES 10K OHM 1% 0,1W 0603; Manufacturer: Stackpole Electronics Inc; Power (Watts): 0.063W, 1/16W; Temperature Coefficient: ±25ppm/°C; Tolerance: ±0.1%; Part Number: RNCS0603BKE10K0; Value: 10k; Composition: Thin Film; Device Package: 0603 (1608 Metric); Features: Anti-Corrosive, Automotive AEC-Q200, Moisture Resistant; Height - Seated (Max): 0.022" (0.55mm); LastUpdated: 09.02.2024 20:43:37; Lifecycle Status: Active; Minimum Order: 1; Number of Terminations: 2; Operating Temperature: -55°C ~ 155°C; Package / Case: 0603 (1608 Metric); Packaging: TapeAndReel; PartId: 4838; Part Status: Active; Price: 0.06; Ratings: AEC-Q200; Resistance: 10k; Series: RNCS; Size / Dimension: 0.061" L x 0.031" W (1.55mm x 0.80mm); Supplier Device Package: 0603
R31 R32 = RNCS0603BKE10K0: RES 4,7K OHM 1% 0,1W 0603; Manufacturer: Stackpole Electronics Inc; Power (Watts): 0.063W, 1/16W; Temperature Coefficient: ±25ppm/°C; Tolerance: ±0.1%; Part Number: RNCS0603BKE10K0; Value: 4,7k; Composition: Thin Film; Device Package: 0603 (1608 Metric); Features: Anti-Corrosive, Automotive AEC-Q200, Moisture Resistant; Height - Seated (Max): 0.022" (0.55mm); LastUpdated: 09.02.2024 20:43:37; Lifecycle Status: Active; Minimum Order: 1; Number of Terminations: 2; Operating Temperature: -55°C ~ 155°C; Package / Case: 0603 (1608 Metric); Packaging: TapeAndReel; PartId: 4838; Part Status: Active; Price: 0.06; Ratings: AEC-Q200; Resistance: 4,7k; Series: RNCS; Size / Dimension: 0.061" L x 0.031" W (1.55mm x 0.80mm); Supplier Device Package: 0603
R33 = RNCS0603BKE10K0: RES 47 OHM 1% 0,1W 0603; Manufacturer: Stackpole Electronics Inc; Power (Watts): 0.063W, 1/16W; Temperature Coefficient: ±25ppm/°C; Tolerance: ±0.1%; Part Number: RNCS0603BKE10K0; Value: 47; Composition: Thin Film; Device Package: 0603 (1608 Metric); Features: Anti-Corrosive, Automotive AEC-Q200, Moisture Resistant; Height - Seated (Max): 0.022" (0.55mm); LastUpdated: 09.02.2024 20:43:37; Lifecycle Status: Active; Minimum Order: 1; Number of Terminations: 2; Operating Temperature: -55°C ~ 155°C; Package / Case: 0603 (1608 Metric); Packaging: TapeAndReel; PartId: 4838; Part Status: Active; Price: 0.06; Ratings: AEC-Q200; Resistance: 47; Series: RNCS; Size / Dimension: 0.061" L x 0.031" W (1.55mm x 0.80mm); Supplier Device Package: 0603
R34 R40 R41 R43-R48 R50-R57 = RNCS0603BKE10K0: RES 470 OHM 1% 0,1W 0603; Manufacturer: Stackpole Electronics Inc; Power (Watts): 0.063W, 1/16W; Temperature Coefficient: ±25ppm/°C; Tolerance: ±0.1%; Part Number: RNCS0603BKE10K0; Value: 470; Composition: Thin Film; Device Package: 0603 (1608 Metric); Features: Anti-Corrosive, Automotive AEC-Q200, Moisture Resistant; Height - Seated (Max): 0.022" (0.55mm); LastUpdated: 09.02.2024 20:43:37; Lifecycle Status: Active; Minimum Order: 1; Number of Terminations: 2; Operating Temperature: -55°C ~ 155°C; Package / Case: 0603 (1608 Metric); Packaging: TapeAndReel; PartId: 4838; Part Status: Active; Price: 0.06; Ratings: AEC-Q200; Resistance: 470; Series: RNCS; Size / Dimension: 0.061" L x 0.031" W (1.55mm x 0.80mm); Supplier Device Package: 0603
R37 R38 = RNCS0603BKE10K0: RES 0 OHM 1% 0,1W 0603; Manufacturer: Stackpole Electronics Inc; Power (Watts): 0.063W, 1/16W; Temperature Coefficient: ±25ppm/°C; Tolerance: ±0.1%; Part Number: RNCS0603BKE10K0; Value: 0; Composition: Thin Film; Device Package: 0603 (1608 Metric); Features: Anti-Corrosive, Automotive AEC-Q200, Moisture Resistant; Height - Seated (Max): 0.022" (0.55mm); LastUpdated: 09.02.2024 20:43:37; Lifecycle Status: Active; Minimum Order: 1; Number of Terminations: 2; Operating Temperature: -55°C ~ 155°C; Package / Case: 0603 (1608 Metric); Packaging: TapeAndReel; PartId: 4838; Part Status: Active; Price: 0.06; Ratings: AEC-Q200; Resistance: 0; Series: RNCS; Size / Dimension: 0.061" L x 0.031" W (1.55mm x 0.80mm); Supplier Device Package: 0603
SW1-SW4 = CMP-08834-000004-1: SWITCH TACTILE SPST-NO 0.05A 24V; Manufacturer: Omron Electronics Inc-EMC Div; Manufacturer Part Number: B3FS-1000; Operating Force: 0.98N; Contact Current Rating: 50mA; Electromechanical Life: 1000000Cycles; Contact Resistance: 100mΩ; Mouser Description: Tactile Switches 6X6X3.1mm 100gF; Height: 3.3mm; Lead Free: Yes; Device Class L1: Electromechanical; RoHS: TRUE; Voltage Rating Dc: 24V; Temperature Range High: +70°C; ComponentLink2Description: Datasheet; Temperature Range Low: -25°C; Temperature: -25°C to +70°C; ComponentLink2URL: https://omronfs.omron.com/en_US/ecb/products/pdf/en-b3fs.pdf; Throw Configuration: SPST-NO; Package: 0; Ambient Temperature Range Low: -25°C; Octopart: https://octopart.com/b3fs-1000-omron-116581; Device Class L3: Tactile Switches; Category: Switch; Automotive: No; Device Class L2: Switches; Ambient Temperature Range High: +70°C; Mount: Surface Mount; Digikey Description: SWITCH TACTILE SPST-NO 0.05A 24V
U2 = NCP51460SN33T1G: Low power precision voltage reference; Iout = 20mA
U3 = CMP-1655-00017-2: Ultra-Low-Power ARM Cortex-M4 32-bit MCU+FPU, 512 KB Flash, 128 KB Internal RAM, 114 I/Os, 144-Pin LQFP, -40 to 85 degC, Tray; Manufacturer: STMicroelectronics; FLASH Size (Prog) (kB): 512; D/A Converter: 2; Operating Frequency(F) (Processor speed) (MHz): 80; Internal RAM Size (kB): 128; Supply Voltage(Vcc) min (V): 1.71; I/Os (High Current): 114; Package Reference: LQFP144; ComponentLink2Description: Datasheet; PartNumber: STM32L476ZET6; ComponentLink1Description: Manufacturer URL; Packing: Tray; ComponentLink1URL: http://www.st.com/; Mounting Technology: Surface Mount; Core: ARM Cortex-M4; Package Description: 144-Pin Low Profile Quad Flat Package, Body 20 x 20 mm, Pitch 0.5 mm; ComponentLink2URL: http://www.st.com/st-web-ui/static/active/en/resource/technical/document/datasheet/DM00108832.pdf; DatasheetVersion: Rev. 4
U4 = TS3704: Micropower push-pusll quad CMOS voltage comparator
U5 = TS3702: Micropower push-pull dual CMOS voltage comparator
U6 = CMP-0315-00075-2: 3.3 V Can Transceiver, 17 mA, -40 to 85 degC, 8-pin SOIC (D), Green (RoHS & no Sb/Br); Manufacturer: Texas Instruments; Supply Voltage(s)(V): 3.3; Receivers Per Package: 1; ICC(Max)(mA): 17; Rating: Catalog; Transient Pulse Protection(V): -25 to 25; Mounting Technology: Surface Mount; PartNumber: SN65HVD232DR; Code_JEDEC: MS-012AA; Eco-Plan: Green (RoHS & no Sb/Br); Isolated: No; SubFamily: CAN; Footprint: SN65HVD232; Drivers Per Package: 1; ComponentLink1URL: http://www.ti.com/general/docs/lit/getliterature.tsp?genericPartNumber=SN65HVD232&fileType=pdf; ComponentLink1Description: Datasheet; PackageDescription: 8-Pin Plastic Small Outline Integrated Circuit, 4.9 x 3.9 mm, Pitch 1.27 mm Pitch; PackageReference: D0008A; DatasheetVersion: SLOS346K; PackageVersion: revM, Jun-2011
U7 = CMP-0802-00008-5: IC MULTIPLEXER DUAL 4X1 16SOIC; Number of Circuits: 2; Nominal Supply Current: 20uA; Turn-On Delay Time: 28ns; Supply Type: Single; High Level Output Current: 25mA; Throw Configuration: SP4T; On-State Resistance: 100R; Number of Inputs: 8; Max Supply Voltage: 5.5V; Min Supply Voltage: 2V; Propagation Delay: 12ns; Bandwidth: 50MHz; Polarity: Non-Inverting; Number of Bits: 4; Number of Channels: 2; Weight: 0.004998oz; Radiation Hardening: No; Min Operating Temperature: -40°C; Logic Function: Multiplexer; Max Operating Temperature: 85°C; REACH SVHC: No SVHC; Mount: Surface Mount; Number of Outputs: 2; Low Level Output Current: 25mA; Case/Package: SOIC; Turn-Off Delay Time: 28ns; RoHS Compliant: Yes; Number of Pins: 16; Operating Supply Current: 20uA; Lead Free: Lead Free; Contact Plating: Gold; Packaging: Tape and Reel; Package Quantity: 1
Y1 = QT532S_CRYSTAL